# EAGLE design weather_station (EAGLE 9.5.2)
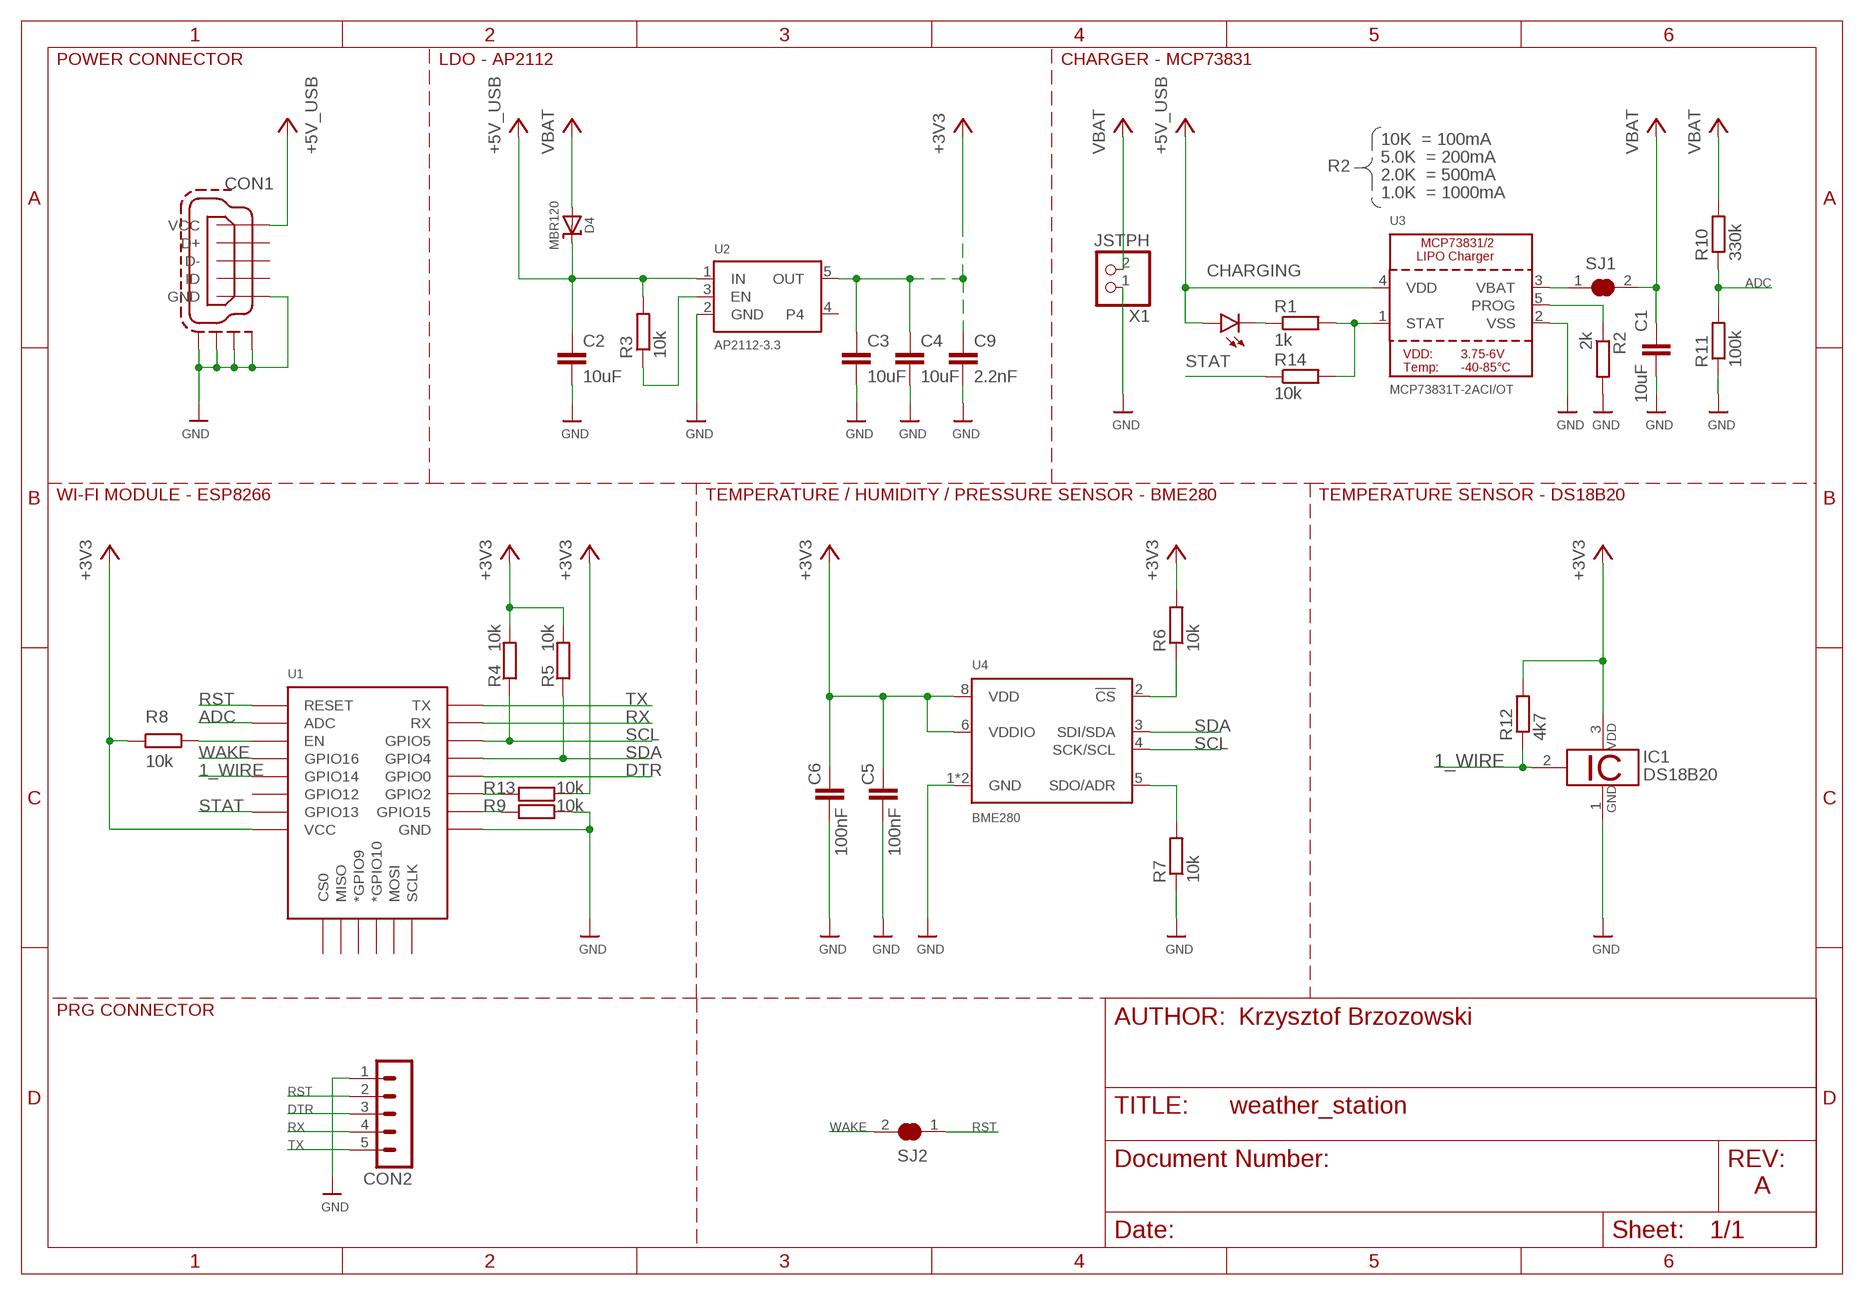
[diagram p0: schematic, sheet 1]

## Parts
C1  10uF  C-EUC1210  [C1210]
C2  10uF  C-EUC1210  [C1210]
C3  10uF  C-EUC1210  [C1210]
C4  10uF  C-EUC1210  [C1210]
C5  100nF  C-EUC0402K  [C0402K]
C6  100nF  C-EUC0402K  [C0402K]
C9  2.2nF  C-EUC0402K  [C0402K]
CHARGING  LEDCHIPLED_0603  [CHIPLED_0603]
CON1  MICROUSB-MOLEX  [MICROUSB-MOLEX]
CON2  MA05-1  [MA05-1]
D4  MBR120  DIODE-SCHOTTKYSOD-123  [SOD-123]
IC1  DS18B20  DS18B20T  [TO92-LNG]
R1  1k  R-EU_R0402  [R0402]
R2  2k  R-EU_R0402  [R0402]
R3  10k  R-EU_R0402  [R0402]
R4  10k  R-EU_R0402  [R0402]
R5  10k  R-EU_R0402  [R0402]
R6  10k  R-EU_R0402  [R0402]
R7  10k  R-EU_R0402  [R0402]
R8  10k  R-EU_R0402  [R0402]
R9  10k  R-EU_R0402  [R0402]
R10  330k  R-EU_R0402  [R0402]
R11  100k  R-EU_R0402  [R0402]
R12  4k7  R-EU_R0402  [R0402]
R13  10k  R-EU_R0402  [R0402]
R14  10k  R-EU_R0402  [R0402]
SJ1  SOLDERJUMPER_CLOSED  [SOLDERJUMPER_CLOSEDWIRE]
SJ2  SOLDERJUMPER_CLOSED  [SOLDERJUMPER_CLOSEDWIRE]
U1  ESP12ESMD  [ESP12E-SMD]
U2  AP2112-3.3  VREG_SOT23-5  [SOT23-5]
U3  MCP73831T-2ACI/OT  MCP73831/2  [SOT23-5]
U4  BME280  [LGA-8-2.5X2.5]
X1  JSTPH  CON_JST_PH_2PIN  [JSTPH2]

## Nets
1_WIRE: IC1.2 R12.1 U1.GPIO14
+3V3: C3.1 C4.1 C5.1 C6.1 C9.1 IC1.3 R4.2 R5.2 R6.2 R8.2 R12.2 R13.1 U1.VCC U2.5(OUT) U4.6(VDDIO) U4.8(VDD)
+5V_USB: C2.1 CHARGING.A CON1.VCC D4.C R3.2 U2.1(IN) U3.4(VDD)
ADC: R10.1 R11.2 U1.ADC
DTR: CON2.3 U1.GPIO0
EN: R3.1 U2.3(EN)
GND: C1.2 C2.2 C3.2 C4.2 C5.2 C6.2 C9.2 CON1.GND CON1.GND_H_00(SH1) CON1.GND_H_01(SH2) CON1.GND_H_02(SH3) CON1.GND_H_03(SH3) CON1.GND_H_04(SH3) CON1.GND_H_05(SH3) CON1.GND_H_06(SH3) CON1.GND_H_07(SH3) CON1.GND_H_08(SH3) CON1.GND_H_09(SH3) CON1.GND_H_10(SH3) CON1.GND_H_11(SH3) CON1.GND_H_12(SH3) CON1.GND_H_13(SH4) CON1.GND_H_14(SH4) CON1.GND_H_15(SH4) CON1.GND_H_16(SH4) CON1.GND_H_17(SH4) CON1.GND_H_18(SH4) CON1.GND_H_19(SH4) CON1.GND_H_20(SH4) CON1.GND_H_21(SH4) CON1.GND_H_22(SH4) CON1.GND_H_23(SH4) CON1.GND_P_0(SH3) CON1.GND_P_1(SH3) CON1.GND_P_2(SH4) CON1.GND_P_3(SH4) CON2.1 IC1.1 R2.2 R7.1 R9.1 R11.1 U1.GND U2.2(GND) U3.2(VSS) U4.1(GND) U4.7(GND) X1.1
N$1: CHARGING.C R1.1
N$2: SJ1.1 U3.3(VBAT)
N$3: R1.2 R14.2 U3.1(STAT)
N$4: R2.1 U3.5(PROG)
N$5: R6.1 U4.2(!CS)
N$6: R7.2 U4.5(SDO/ADR)
N$7: R13.2 U1.GPIO2
N$12: R8.1 U1.CH_PD(EN)
N$13: R9.2 U1.GPIO15
RST: CON2.2 SJ2.1 U1.RESET
RX: CON2.4 U1.RXD0(RX)
SCL: R4.1 U1.GPIO5 U4.4(SCK/SCL)
SDA: R5.1 U1.GPIO4 U4.3(SDI/SDA)
STAT: R14.1 U1.GPIO13
TX: CON2.5 U1.TXD0(TX)
VBAT: C1.1 D4.A R10.2 SJ1.2 X1.2
WAKE: SJ2.2 U1.GPIO16
Unconnected: CON1.D+ CON1.D- CON1.ID U1.CS0 U1.GPIO9(*GPIO9) U1.GPIO10(*GPIO10) U1.GPIO12 U1.MISO U1.MOSI U1.SCLK U2.4

## Notes on the sheet
- POWER CONNECTOR | LDO - AP2112 | CHARGER - MCP73831
- 10K  = 100mA
- 5.0K  = 200mA
- R2
- 2.0K  = 500mA
- 1.0K  = 1000mA
- WI-FI MODULE - ESP8266 | TEMPERATURE / HUMIDITY / PRESSURE SENSOR - BME280 | TEMPERATURE SENSOR - DS18B20
- PRG CONNECTOR
- AUTHOR: | Krzysztof Brzozowski
- A

## Library data of the parts
C1-C6 C9 = rcl:C-EU: CAPACITOR, European symbol; SPICEPREFIX: C
CHARGING = led:LED: LED OSRAM: - CHIPLED LG R971, LG N971, LY N971, LG Q971, LY Q971, LO R971, LY R971 LH N974, LH R974 LS Q976, LO Q976, LY Q976 LO Q996 - Hyper CHIPLED LW Q18S LB Q993, LB Q99A, LB R99A - SideLED LS A670, LO A670, LY A670, LG A670, LP A670 LB A673, LV A673, LT A673, LW A673 LH A674 LY A675 LS A676, LA A676, LO A676, LY A676, LW A676 LS A679, LY A679, LG A679 - Hyper Micro SIDELED® LS Y876, LA Y876, LO Y876, LY Y876 LT Y87S - SmartLED LW L88C, LW L88S LB L89C, LB L89S, LG L890 LS L89K, LO L89K, LY L89K LS L896, LA L896, LO L896, LY L896 - TOPLED LS T670, LO T670, LY T670, LG T670, LP T670 LSG T670, LSP T670, LSY T670, LOP T670, LYG T670 LG T671, LOG T671, LSG T671 LB T673, LV T673, LT T673, LW T673 LH T674 LS T676, LA T676, LO T676, LY T676, LB T676, LH T676, LSB T676, LW T676 LB T67C, LV T67C, LT T67C, LS T67K, LO T67K, LY T67K, LW E67C LS E67B, LA E67B, LO E67B, LY E67B, LB E67C, LV E67C, LT E67C LW T67C LS T679, LY T679, LG T679 LS T770, LO T770, LY T770, LG T770, LP T770 LB T773, LV T773, LT T773, LW T773 LH T774 LS E675, LA E675, LY E675, LS T675 LS T776, LA T776, LO T776, LY T776, LB T776 LHGB T686 LT T68C, LB T68C - Hyper Mini TOPLED® LB M676 - Mini TOPLED Santana® LG M470 LS M47K, LO M47K, LY M47K Source: http://www.osram.convergy.de LUXEON: - LUMILED® LXK2-PW12-R00, LXK2-PW12-S00, LXK2-PW14-U00, LXK2-PW14-V00 LXK2-PM12-R00, LXK2-PM12-S00, LXK2-PM14-U00 LXK2-PE12-Q00, LXK2-PE12-R00, LXK2-PE12-S00, LXK2-PE14-T00, LXK2-PE14-U00 LXK2-PB12-K00, LXK2-PB12-L00, LXK2-PB12-M00, LXK2-PB14-N00, LXK2-PB14-P00, LXK2-PB14-Q00 LXK2-PR12-L00, LXK2-PR12-M00, LXK2-PR14-Q00, LXK2-PR14-R00 LXK2-PD12-Q00, LXK2-PD12-R00, LXK2-PD12-S00 LXK2-PH12-R00, LXK2-PH12-S00 LXK2-PL12-P00, LXK2-PL12-Q00, LXK2-PL12-R00 Source: www.luxeon.com KINGBRIGHT: KA-3528ASYC Source: www.kingbright.com
CON1 = microusb-molex:MICROUSB-MOLEX
CON2 = con-lstb_weather_sensor:MA05-1: PIN HEADER; OC_FARNELL: unknown; OC_NEWARK: unknown
D4 = microbuilder:DIODE-SCHOTTKY
IC1 = 1wire:DS18B20: Programmable Resolution Digital Thermometer This chip provides a onewire thermosensor with approx. 0.5°C accuracy. A programmable over/undertemperure alarm is available. The precision can be set from 9..12 bits. Notes: Vdd must be applied for accurate measurements at low temperatures, as the parasite power circuit otherwise heats the sensor. If parasite power is used, Vdd has to be connected to GND. The DS1822 is a low-cost thermometer chip, the DS18S20 is similar to the DS18B20, but with 9 Bit precision only. Author: Jan Kandziora <jjj@gmx.de>
R1-R14 = rcl:R-EU_: RESISTOR, European symbol; SPICEPREFIX: R
SJ1 SJ2 = microbuilder:SOLDERJUMPER_CLOSED: Solder Jumper - Closed These solder jumpers are closed by default CLOSEDWIRE - 10 mil trace between pads that can be cut and resoldered later CLOSEDPERM - 63 mil trace between pads for a permanent connection (used to 'bridge' two signals, a shameless hack for Eagle). Can double as a test point as well (no cream layer)
U1 = esp8266modules:ESP12E: ESP12E Module
U2 = microbuilder:VREG_SOT23-5: SOT23-5 Fixed Voltage Regulators Part Current Out V Out V In V Dropout θJA (°C/W) TJ (°C) Digikey Part No. ADP121 150mA 3.3V 3.4-5.5V 0.09V @ 150mA -- -- ADP121-AUJZ33R7CT-ND ADP121 150mA 3.0V 3.1-5.5V 0.09V @ 150mA -- -- ADP121-AUJZ30R7CT-ND ADP122 300mA 3.3V 3.4-5.5V 0.085V @ 300mA -- -- ADP122AUJZ-3.3-R7CT-ND ADP1712 300mA 3.3V 3.5-5.5V 0.17V @ 300mA -- -- ADP1712AUJZ-3.3-R7TR-ND AP7311 (Low Cost) 150mA 3.3V 3.5-6V 0.15V @ 150mA -- -- AP7311-33WG-7DICT-ND LD39015M18R 150mA 1.8V 1.9V-5.5V 0.08V @ 100mA -- -- 497-6977-1-ND LP2985A-33DBVR 150mA 3.3V 3.3-16V 0.28V @ 150mA 206 150 296-18479-1-ND MCP1824T-3302E/OT 300mA 3.3V 3.5V-6V 0.2V @ 300mA -- -- MCP1824T-3302E/OTCT-ND MIC5205-2.5YM5 TR 150mA 2.5V 2.7-16V 0.165V @ 150mA -- -- 576-1257-2-ND MIC5205-3.0YM5 TR 150mA 3.0V 3.2V-16V 0.165V @ 150mA -- -- 576-1258-2-ND MIC5205-3.3YM5 TR 150mA 3.3V 3.5V-16V 0.165V @ 150mA -- -- 576-1259-2-ND TPS780330220 150mA 3.3V+2.2V 3.6-5.5V 250mV Max -- -- 296-23332-1-ND TDA3663/N1,135 100mA 3.3V 3.5-45V 0.18V @ 50mA -- -- 568-5343-1-ND Max operating temp can be calculated using θJA, TJ (max junction temperature), and power in watts. Set the "Maximum Ambient Temperature" until it reaches TJ ("Max Junction Temperature"), which is the absolute limit for safe use of the regulator: Heat Sink Temperature Calculator <http://www.daycounter.com/Calculators/Heat-Sink-Temperature-Calculator.phtml> For example, With 12V source into a 3.3V LP2985 and a 30mA load, we are dissipating (12V-3.3V) * 0.03A = 0.261W. With a θJA of 206 °C/W, a TJ of 150°C, and 261mW we can safely use the chip without a heat sink up to 75°C (=147.1°C Junction Temperature).
U3 = microbuilder:MCP73831/2: MCP73831/2 LIPO Charger VDD: 3.75 - 6V Temp -40 - 85°C Programmable Charge Rate: 15-500mA NOTE: STAT is a tri-state logic output on the MCP73831 and an open-drain output on the MCP73832. SOT23-5 with 4.2V output and tri-state logic on STAT = MCP73831T-2ACI/OT
U4 = SparkFun-Sensors:BME280: Bosch BME280 – Combined Humidity and Pressure Sensor The BME280 is as combined digital humidity, pressure and temperature sensor based on proven sensing principles. The sensor module is housed in an extremely compact metal-lid LGA package with a footprint of only 2.5×2.5mm² with a height of 0.93mm. Its small dimensions and its low power consumption allow the implementation in battery driven devices such as handsets, GPS modules or watches. Datasheet <https://cdn.sparkfun.com/assets/learn_tutorials/4/1/9/BST-BME280_DS001-10.pdf> SparkFun Products SparkFun Atmospheric Sensor Breakout - BME280 <https://www.sparkfun.com/products/13676> (SEN-13676); PROD_ID: IC-13090
X1 = microbuilder:CON_JST_PH_2PIN: JST 2-Pin Right-Angle Connector PH-Series - 4UConnector: 17311 SH-Series - 4UConnector: 07278

## Net classes
0 default: width 0.254 mm, drill 0.2 mm, clearance 0.127 mm

## Board
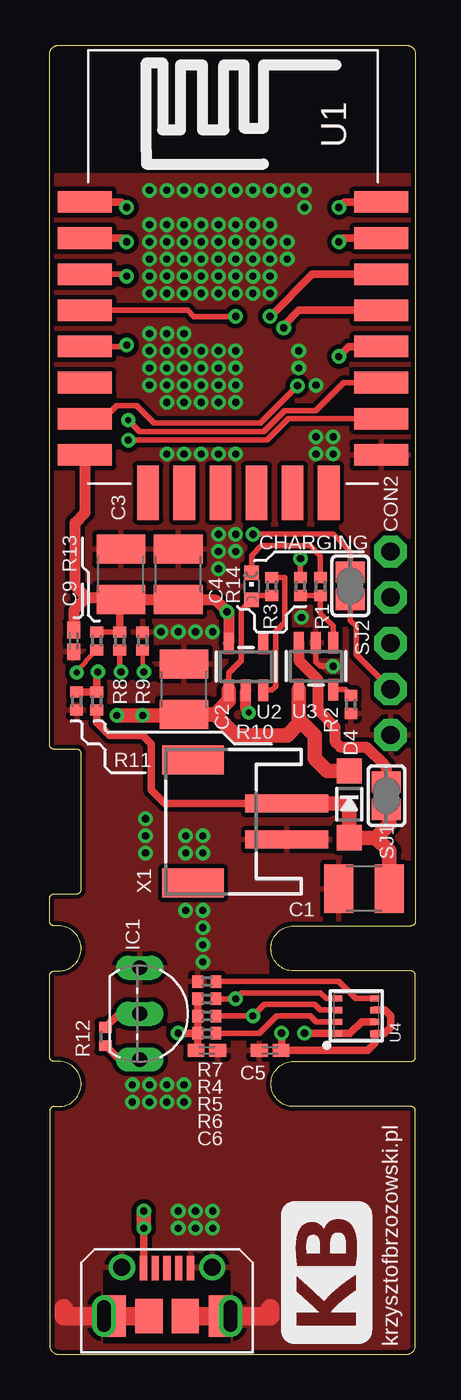
[diagram p1: board, top side]
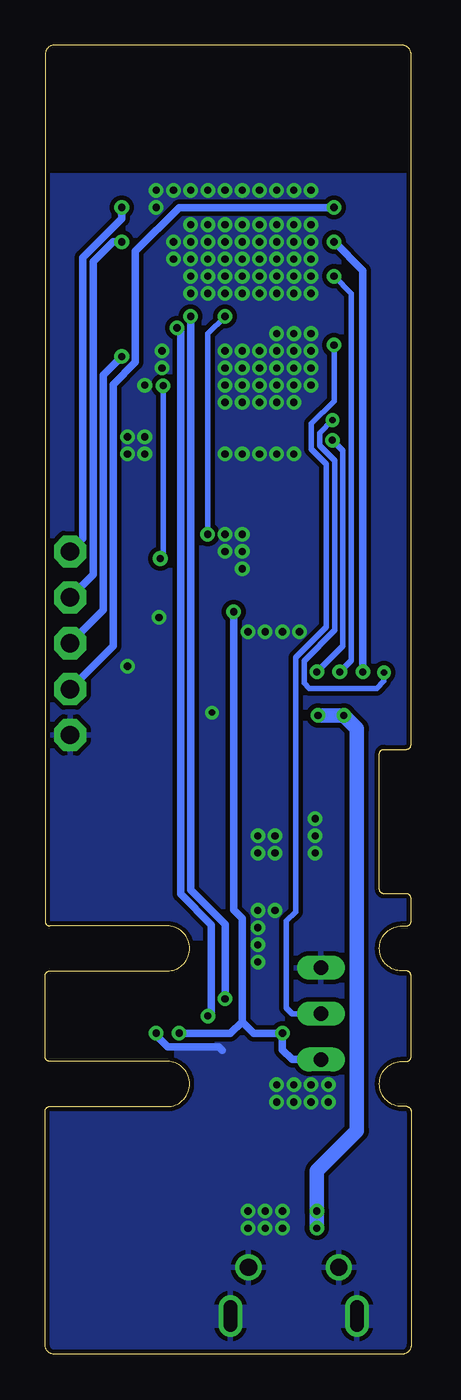
[diagram p2: board, bottom side, seen from below]

Size 20.25 x 72.48 mm. Coordinates in mm from the lower left corner, seen from the top.
Outline: 0.5,0 19.75,0 arc90 20.25,0.5 20.25,13.47 arc90 20,13.72 13.5,13.72 arc-90 12.25,14.97 arc-90 13.5,16.22 20,16.22 arc90 20.25,16.47 20.25,20.97 arc90 20,21.22 13.5,21.22 arc-90 12.25,22.47 arc-90 13.5,23.72 20,23.72 arc90 20.25,23.97 20.25,71.98 arc90 19.75,72.48 0.5,72.48 arc90 0,71.98 0,33.75 arc90 0.25,33.5 1.5,33.5 arc-90 1.75,33.25 1.75,25.75 arc-90 1.5,25.5 0.25,25.5 arc90 0,25.25 0,23.97 arc90 0.25,23.72 0.5,23.72 arc-90 1.75,22.47 arc-90 0.5,21.22 0.25,21.22 arc90 0,20.97 0,16.47 arc90 0.25,16.22 0.5,16.22 arc-90 1.75,14.97 arc-90 0.5,13.72 0.25,13.72 arc90 0,13.47 0,0.5 arc90 0.5,0
Copper layers (1*16): Top 0.035mm / dielectric 0.15mm / Bottom 0.035mm
Design rules "default *": minimum track width 6mil, minimum drill 0.35mm, track to track 6mil, track to pad 6mil, pad to pad 6mil, via to via 6mil, smd to smd 6mil, copper to edge 8mil, drill to drill 6mil, minimum pad ring 10mil, minimum via ring 8mil, stop-mask expansion 4mil, vias tented up to drill 50mil, thermal gap 10mil

### Footprints (pad centres in the part's own frame; a part is rotated, then mirrored left to right if it is on the bottom)
C1210 = smd 1.6 x 2.7: 1 -1.4,0; 2 1.4,0
C0402K = smd 0.925 x 0.74: 1 -0.6,0; 2 0.6,0
CHIPLED_0603 = smd 0.8 x 0.8: A 0,-0.75; C 0,0.75
MICROUSB-MOLEX = smd 0.4 x 1.35: D+ 0,1.45; D- -0.65,1.45; GND 1.3,1.45; ID 0.65,1.45; VCC -1.3,1.45 | drill 0.95: GND_H_00 -2.5,1.5; GND_H_01 2.5,1.5 | drill 0.75 pad 1.3: GND_H_02 -3.5,-0.7; GND_H_03 -3.5,-0.8; GND_H_04 -3.5,-0.9; GND_H_05 -3.5,-1; GND_H_06 -3.5,-1.1; GND_H_07 -3.5,-1.2; GND_H_08 -3.5,-1.3; GND_H_09 -3.5,-1.4; GND_H_10 -3.5,-1.5; GND_H_11 -3.5,-1.6; GND_H_12 -3.5,-1.7; GND_H_13 3.5,-1.6; GND_H_14 3.5,-0.7; GND_H_15 3.5,-0.8; GND_H_16 3.5,-0.9; GND_H_17 3.5,-1; GND_H_18 3.5,-1.1; GND_H_19 3.5,-1.2; GND_H_20 3.5,-1.3; GND_H_21 3.5,-1.4; GND_H_22 3.5,-1.5; GND_H_23 3.5,-1.7 | smd 1.2 x 2.3: GND_P_0 -2.9,-1.2; GND_P_3 2.9,-1.2 | smd 1.5 x 1.9: GND_P_1 -1,-1.2; GND_P_2 1,-1.2
MA05-1 = drill 1.016 pad 1.778 octagon: 1 -5.08,0; 2 -2.54,0; 3 0,0; 4 2.54,0; 5 5.08,0
SOD-123 = smd 1.4 x 1.4: A 1.85,0; C -1.85,0
TO92-LNG = drill 0.813 long: 1 -2.54,0; 2 0,0; 3 2.54,0
R0402 = smd 0.6 x 0.7: 1 -0.5,0; 2 0.5,0
SOLDERJUMPER_CLOSEDWIRE = smd 1.168 x 1.6: 1 -0.762,0; 2 0.762,0 | smd 0.635 x 0.203: WIRE 0,0
ESP12E-SMD = smd 3 x 1.2: ADC -8.3,3.8; CH_PD -8.3,1.8; GND 8.1,-8.2; GPIO0 8.1,-2.2; GPIO2 8.1,-4.2; GPIO4 8.1,-0.2; GPIO5 8.1,1.8; GPIO12 -8.3,-4.2; GPIO13 -8.3,-6.2; GPIO14 -8.3,-2.2; GPIO15 8.1,-6.2; GPIO16 -8.3,-0.2; RESET -8.3,5.8; RXD0 8.1,3.8; TXD0 8.1,5.8; VCC -8.3,-8.2 | smd 1.2 x 3: CS0 -4.8,-10.3; GPIO9 -0.8,-10.3; GPIO10 1.2,-10.3; MISO -2.8,-10.3; MOSI 3.2,-10.3; SCLK 5.2,-10.3
SOT23-5 = smd 0.55 x 1.2: 1 -0.95,-1.3; 2 0,-1.3; 3 0.95,-1.3; 4 0.95,1.3; 5 -0.95,1.3
LGA-8-2.5X2.5 = smd 0.35 x 0.5: 1 -0.975,1.025; 2 -0.325,1.025; 3 0.325,1.025; 4 0.975,1.025; 5 0.975,-1.025; 6 0.325,-1.025; 7 -0.325,-1.025; 8 -0.975,-1.025
JSTPH2 = smd 1 x 4.6: 1 -1,-3.7; 2 1,-3.7 | smd 1.6 x 3.4: NC1 -3.4,1.5; NC2 3.4,1.5

### Placement (x,y rotation side)
C1  17.4,25.78 180 top
C2  7.44,36.83 90 top
C3  3.94,43.18 90 top
C4  7.12,43.18 90 top
C5  12.2,16.83 180 top
C6  8.71,16.83 0 top
C9  1.34,39.5 270 top
CHARGING  11.18,42.52 0 top
CON1  6.5,3.32 0 top
CON2  18.87,39.37 90 top
D4  16.58,30.45 270 top
IC1  4.99,18.86 270 top
R1  14.99,42.52 270 top
R2  16.67,35.98 270 top
R3  12.29,42.52 270 top
R4  8.71,19.68 180 top
R5  8.71,18.73 180 top
R6  8.71,17.78 180 top
R7  8.71,20.64 0 top
R8  3.88,39.5 90 top
R9  5.15,39.5 270 top
R10  2.61,36.17 270 top
R11  1.5,36.17 90 top
R12  3.08,17.59 270 top
R13  2.61,39.5 270 top
R14  13.88,42.52 270 top
SJ1  18.64,30.93 270 top
SJ2  16.64,42.54 90 top
U1  10.25,58 0 top
U2  10.86,38.07 0 top
U3  14.74,38.1 180 top
U4  16.96,18.73 90 top
X1  9.43,29.5 90 top

### Tracks (layer width: path | path; a pad name or v marks a point on that pad's centre or on a via)
1_WIRE  (via drill 0.4)
  Top 0.305: U1.GPIO14 4.18,55.8 v4.26,55.88
  Top 0.406: R12.1 3.85,18.86 IC1.2
  Bottom 0.305: IC1.2 6.58,18.86 6.89,19.18 6.89,23.99 6.38,24.5 6.38,38.58 4.68,40.28 4.68,49.29 5.52,50.13 5.52,51.52 4.26,52.78 v4.26,55.88
+3V3  (via drill 0.4)
  Top 0.305: R13.1 R8.2
  Top 0.406: v7.12,17.78 R6.2 | R6.2 8.21,16.93 C6.1 | R6.2 R5.2 R4.2 | C3.1 3.88,41.71 R8.2 | v12.83,17.78 12.83,16.86 C5.1 17.6,16.83 17.99,17.22 U4.8 18.53,17.76 18.87,18.1 18.87,18.73 18.54,19.06 U4.6 | R12.2 3.85,16.32 IC1.3
  Top 0.61: U1.VCC 1.95,46.58 1.4,46.04 1.4,42.54 2.07,41.88 | 2.07,41.88 3.84,41.88 C3.1 C4.1 9.15,41.78 v9.82,41.12 9.91,41.02 U2.5 | 2.07,41.88 2.01,41.88 1.34,41.21 C9.1
  Bottom 0.406: 9.34,18.41 8.71,17.78 v7.12,17.78 7.12,16.87 6.58,16.32 IC1.3 | 9.34,18.41 10,17.76 12.81,17.76 v12.83,17.78 | v9.82,41.12 9.82,24.61 9.34,24.13 9.34,18.41
+5V_USB  (via drill 0.4)
  Top 0.305: U2.1 9.91,37.72 10.61,38.42 10.61,41.2 CHARGING.A 11.43,42.02 R3.2
  Top 0.406: CON1.VCC 5.2,6.97 v5.21,6.98
  Top 0.813: U3.4 13.79,35.15 | 13.79,35.15 13.79,34.93 13.14,34.28 10.31,34.28 9.15,35.43 | 9.15,35.43 C2.1 7.59,35.43 7.53,35.37 v5.15,35.37 v3.72,35.37 | 9.15,35.43 9.91,36.19 U2.1 | v5.21,6.98 v5.21,7.94 | 13.79,35.15 14.67,34.26 14.67,32.99 15.36,32.3 D4.C
  Bottom 0.813: v5.15,35.37 v3.72,35.37 2.99,34.65 2.99,12.38 5.21,10.16 v5.21,7.94 v5.21,6.98
ADC  (via drill 0.4)
  Top 0.406: v2.67,37.78 2.61,37.72 R10.1 R11.2 | U1.ADC 4.06,61.8 v4.26,61.59
  Bottom 0.406: v2.67,37.78 2.67,60 v4.26,61.59
CO_0
  cutout Top (isolate 0.254): 21.09,22.54 12.2,22.54 12.2,14.92 21.09,14.92
CO_1
  cutout Bottom (isolate 0.254): 21.41,22.86 10.93,22.86 10.93,17.14 13.15,17.14 13.15,14.61 21.41,14.61
CO_2
  cutout Top (isolate 0.254): 2.99,0.64 2.99,4.6 9.98,4.6 9.98,0.64
CO_3
  cutout Top (isolate 0.254): 10.61,38.1 12.84,38.1 12.84,34.92 10.61,34.92
CO_4
  cutout Top: 16.26,27.75 16.26,23.94 18.32,23.94 18.32,27.75
CO_5
  cutout Top: 15.63,36.17 16.74,36.17 16.74,35.37 15.63,35.37
DTR  (via drill 0.4)
  Top 0.406: U1.GPIO0 16.56,55.8 v16.01,55.24
  Bottom 0.406: v16.01,55.24 17.04,54.22 17.04,41.2 CON2.3
EN
  Top 0.305: U2.3 12.3,36.77 12.52,36.99 12.52,40.01 13.01,40.51 13.01,43.02 R3.1
GND  (via drill 0.35, 0.4)
  Top 0.305: U3.2 14.74,38.33 14.97,38.1 v15.69,38.1
  Top 0.406: U4.7 17.27,18.41 16.62,17.76 U4.1 14.13,17.76 v14.1,17.78
  Top 0.61: U2.2 10.86,35.69 v11.02,35.53
  Top 1.016: CON1.GND_P_1 CON1.GND_P_0 0.77,2.12 0.77,2.54 | CON1.GND_P_2 CON1.GND_P_3 12.2,2.12 12.2,2.54
  Bottom 0.406: v14.1,17.78 14.1,17.66 13.47,17.02 10.65,17.02 10.45,16.83
  other vias: 10.29,45.4 10.29,44.45 8.07,40 7.12,40 6.17,40 15.69,49.85 14.74,49.85 14.74,50.8 15.69,50.8 7.12,6.99 7.12,7.94 8.07,7.94 8.07,6.99 9.03,6.99 9.03,7.94 9.03,40 9.34,45.4 9.34,44.45 9.34,43.5 7.53,24.58 8.48,24.58 7.44,13.97 7.44,14.92 8.39,52.7 9.34,52.7 10.29,52.7 10.29,49.85 9.34,49.85 10.29,58.74 9.34,58.74 8.39,58.74 8.39,59.69 9.34,59.69 10.29,59.69 6.48,52.7 7.44,52.7 10.29,53.66 10.29,54.61 9.34,53.66 9.34,54.61 8.39,54.61 8.39,53.66 7.44,53.66 7.44,54.61 6.48,54.61 6.48,53.66 5.53,53.66 5.53,54.61 5.53,55.56 6.48,55.56 7.44,55.56 8.39,55.56 9.34,55.56 10.29,55.56 14.74,53.66 13.79,54.61 13.79,55.56 5.53,56.51 6.48,56.51 7.44,56.51 7.44,58.74 6.48,58.74 5.53,58.74 5.53,59.69 6.48,59.69 7.44,59.69 11.25,58.74 12.2,58.74 12.2,59.69 11.25,59.69 5.53,60.64 6.48,60.64 7.44,60.64 8.39,60.64 9.34,60.64 10.29,60.64 11.25,60.64 12.2,60.64 13.15,60.64 13.15,61.59 12.2,61.59 11.25,61.59 11.25,62.55 12.2,62.55 10.29,62.55 10.29,61.59 9.34,61.59 9.34,62.55 8.39,62.55 8.39,61.59 7.44,61.59 7.44,62.55 6.48,62.55 6.48,61.59 5.53,61.59 5.53,62.55 7.44,64.45 5.53,64.45 6.48,64.45 8.39,64.45 9.34,64.45 10.29,64.45 11.25,64.45 12.2,64.45 13.15,64.45 14.11,64.45 14.11,63.5 8.39,49.85 7.44,49.85 6.48,49.85 5.31,28.71 5.31,27.75 6.48,14.92 5.53,14.92 4.58,14.92 4.58,13.97 5.53,13.97 6.48,13.97 8.48,23.63 8.48,22.67 8.48,21.72 8.48,27.75 8.48,28.71 7.53,28.71 7.53,27.75 5.31,29.66 13.95,40.8
  pour Top (isolate 0.254): -1.77,65.25 21.09,65.25 21.09,-1.27 -1.77,-1.27
  pour Bottom (isolate 0.254): -3.04,65.25 22.36,65.25 22.36,-2.54 -3.04,-2.54
N$1
  Top 0.305: CHARGING.C 11.18,44.22 11.72,44.77 14.42,44.77 14.99,44.2 R1.1
N$2
  Top 0.305: 18.64,31.7 SJ1.1
  Top 0.61: U3.3 13.79,38.41 14.83,37.37 14.83,35.69 15.78,34.74 15.78,33.94 16.1,33.63 17.53,33.63 18.48,32.67 18.64,32.52 18.64,31.7
N$3
  Top 0.305: U3.1 15.69,40.32 14.99,41.02 R1.2 R14.2
N$4
  Top 0.305: U3.5 16.35,36.8 R2.1
N$5
  Top 0.305: R6.1 11.61,17.78 12.57,18.73 14.42,18.73 14.75,18.41 U4.2
N$6
  Top 0.305: U4.5 16.94,19.71 16.01,20.64 R7.2
N$7  (via drill 0.35)
  Top 0.254: R13.2 1.99,38.38 1.99,38.32 1.5,37.83 v1.5,37.75
  Top 0.305: U1.GPIO2 16.27,53.8 14.73,52.26 13.01,52.26 11.85,51.1 4.98,51.1 v4.35,51.72
  Bottom 0.305: v4.35,51.72 5.06,51.02 5.06,50.32 4.22,49.48 4.22,40.09 5.92,38.39 5.92,37.17 5.62,36.87 1.9,36.87 1.5,37.28 v1.5,37.75
N$12  (via drill 0.4)
  Top 0.305: R8.1 3.88,37.85 v3.94,37.78 | U1.CH_PD 4.15,59.8 v4.26,59.69
  Bottom 0.305: v4.26,59.69 3.31,58.74 3.31,38.42 v3.94,37.78
N$13  (via drill 0.4)
  Top 0.254: R9.2 5.15,37.85 v5.21,37.78
  Top 0.305: U1.GPIO15 13.2,51.8 12.01,50.61 v4.35,50.61
  Bottom 0.305: v5.21,37.78 3.77,39.23 3.77,50.03 v4.35,50.61
RST  (via drill 0.4)
  Top 0.305: SJ2.1 16.64,40.64 16.96,40.32 16.96,38.73 CON2.2
  Top 0.406: U1.RESET 3.96,63.8 v4.26,63.5
  Bottom 0.406: CON2.2 16.48,39.22 16.48,53.7 15.25,54.93 15.25,61.08 12.83,63.5 v4.26,63.5
RX  (via drill 0.4)
  Top 0.406: U1.RXD0 16.21,61.8 v16.01,61.59
  Bottom 0.406: v16.01,61.59 16.49,61.59 17.6,60.49 17.6,43.18 CON2.4
SCL  (via drill 0.4)
  Top 0.305: U4.4 15.3,19.71 14.98,20.02 10.63,20.02 v10.29,19.68 R4.1
  Top 0.406: v12.2,57.47 14.53,59.8 U1.GPIO5
  Bottom 0.406: v12.2,57.47 12.2,25.72 10.29,23.81 v10.29,19.68
SDA  (via drill 0.4)
  Top 0.305: U4.3 14.98,19.06 14.67,19.37 11.89,19.37 v11.25,18.73 R5.1
  Top 0.406: U1.GPIO4 13.8,57.8 12.96,56.96 v12.96,56.83
  Bottom 0.406: v11.25,18.73 11.05,18.93 11.05,23.78 12.76,25.49 12.76,56.63 v12.96,56.83
STAT  (via drill 0.4)
  Top 0.305: R14.1 v13.88,44.06 13.88,44.1 | v13.72,53.63 11.65,51.56 5.79,51.56 4.83,52.52 3.72,52.52 3,51.8 U1.GPIO13
  Bottom 0.305: v13.88,44.06 13.72,44.22 v13.72,53.63
TX  (via drill 0.4)
  Top 0.406: U1.TXD0 16.31,63.8 v16.01,63.5
  Bottom 0.406: v16.01,63.5 16.01,62.86 18.16,60.72 18.16,45.16 CON2.5
VBAT
  Top 0.254: SJ1.2 18.69,30.21 18.8,30.21
  Top 0.406: R10.2 2.61,34.99 3.34,34.26 5.15,34.26 5.62,33.79 5.62,31.25 6.37,30.5 X1.2
  Top 0.813: X1.2 16.37,30.5 16.58,30.29 D4.A 18.06,28.6 | 18.06,28.6 18.8,29.34 18.8,30.21 | C1.1 18.8,27.86 18.06,28.6
WAKE  (via drill 0.4)
  Top 0.305: SJ2.2 16.64,44.45 15.69,45.4 v11.25,45.4 | U1.GPIO16 7.65,57.8 7.98,57.47 v10.29,57.47
  Bottom 0.305: v11.25,45.4 11.25,56.51 v10.29,57.47

### Text on the board
tNames: krzysztofbrzozowski.pl